# Altium schematic sheet Connector.SchDoc: CONNECTOR
size A4; DrawnBy: ThanhQuoc; Revision: V01; SheetNumber: 20; SheetTotal: 21; Project: RV1126 CAMERA BOARD DESIGN
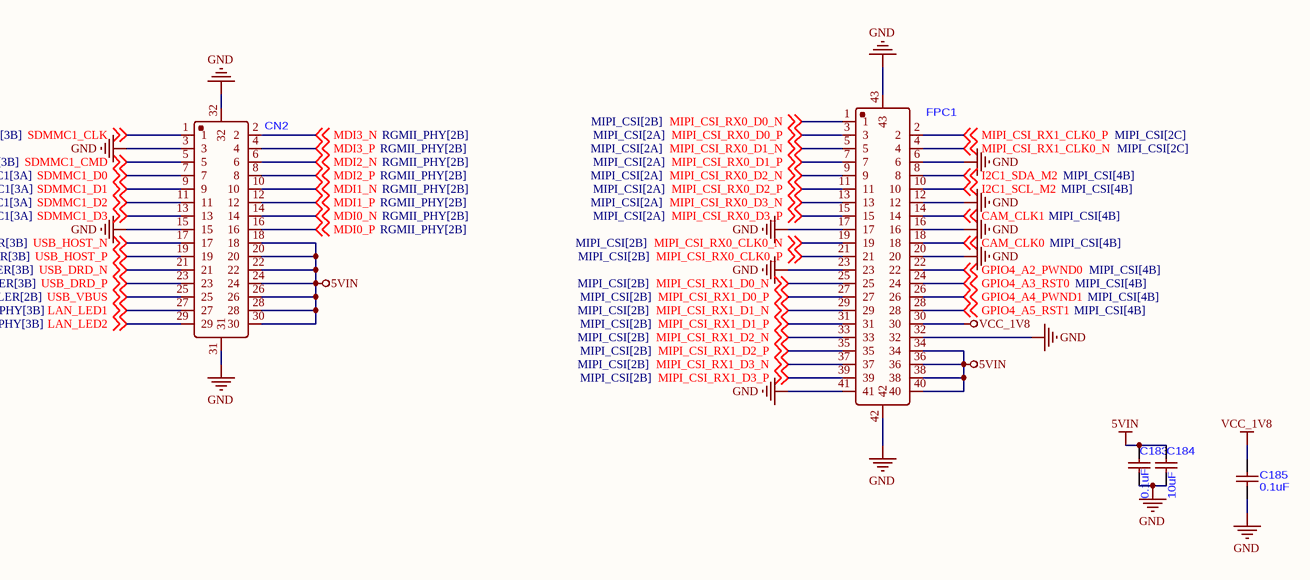
[diagram p0: Connector.SchDoc]

## Parts
C183  0.1uF  [C0201]
C184  10uF  [C0402]
C185  0.1uF  [C0201]
CN2  DF12NB(3.0)-30DP-0.5V(51)  [CONN-SMD_30P-P0.50_HRS_DF12NB-3.0-30DP-0.5V]  (value not drawn)
FPC1  FH35C-41S-0.3SHW(50)  [FPC-SMD_FH35C-41S-0.3SHW-50]  (value not drawn)

## Nets
5VIN: C183.2 C184.2 CN2.18 CN2.20 CN2.22 CN2.24 CN2.26 CN2.28 CN2.30 FPC1.34 FPC1.36 FPC1.38 FPC1.40
GND: C183.1 C184.1 C185.1 CN2.3 CN2.15 CN2.31 CN2.32 FPC1.6 FPC1.12 FPC1.16 FPC1.17 FPC1.20 FPC1.23 FPC1.32 FPC1.41 FPC1.42 FPC1.43
VCC_1V8: C185.2 FPC1.30
CAM_CLK0: FPC1.18 ; off-sheet CAM_CLK0
CAM_CLK1: FPC1.14 ; off-sheet CAM_CLK1
GPIO4_A2_PWND0: FPC1.22 ; off-sheet GPIO4_A2_PWND0
GPIO4_A3_RST0: FPC1.24 ; off-sheet GPIO4_A3_RST0
GPIO4_A4_PWND1: FPC1.26 ; off-sheet GPIO4_A4_PWND1
GPIO4_A5_RST1: FPC1.28 ; off-sheet GPIO4_A5_RST1
I2C1_SCL_M2: FPC1.10 ; off-sheet I2C1_SCL_M2
I2C1_SDA_M2: FPC1.8 ; off-sheet I2C1_SDA_M2
LAN_LED1: CN2.27 ; off-sheet LAN_LED1
LAN_LED2: CN2.29 ; off-sheet LAN_LED2
MDI0_N: CN2.14 ; off-sheet MDI0_N
MDI0_P: CN2.16 ; off-sheet MDI0_P
MDI1_N: CN2.10 ; off-sheet MDI1_N
MDI1_P: CN2.12 ; off-sheet MDI1_P
MDI2_N: CN2.6 ; off-sheet MDI2_N
MDI2_P: CN2.8 ; off-sheet MDI2_P
MDI3_N: CN2.2 ; off-sheet MDI3_N
MDI3_P: CN2.4 ; off-sheet MDI3_P
MIPI_CSI_RX0_CLK0_N: FPC1.19 ; off-sheet MIPI_CSI_RX0_CLK0_N
MIPI_CSI_RX0_CLK0_P: FPC1.21 ; off-sheet MIPI_CSI_RX0_CLK0_P
MIPI_CSI_RX0_D0_N: FPC1.1 ; off-sheet MIPI_CSI_RX0_D0_N
MIPI_CSI_RX0_D0_P: FPC1.3 ; off-sheet MIPI_CSI_RX0_D0_P
MIPI_CSI_RX0_D1_N: FPC1.5 ; off-sheet MIPI_CSI_RX0_D1_N
MIPI_CSI_RX0_D1_P: FPC1.7 ; off-sheet MIPI_CSI_RX0_D1_P
MIPI_CSI_RX0_D2_N: FPC1.9 ; off-sheet MIPI_CSI_RX0_D2_N
MIPI_CSI_RX0_D2_P: FPC1.11 ; off-sheet MIPI_CSI_RX0_D2_P
MIPI_CSI_RX0_D3_N: FPC1.13 ; off-sheet MIPI_CSI_RX0_D3_N
MIPI_CSI_RX0_D3_P: FPC1.15 ; off-sheet MIPI_CSI_RX0_D3_P
MIPI_CSI_RX1_CLK0_N: FPC1.4 ; off-sheet MIPI_CSI_RX1_CLK0_N
MIPI_CSI_RX1_CLK0_P: FPC1.2 ; off-sheet MIPI_CSI_RX1_CLK0_P
MIPI_CSI_RX1_D0_N: FPC1.25 ; off-sheet MIPI_CSI_RX1_D0_N
MIPI_CSI_RX1_D0_P: FPC1.27 ; off-sheet MIPI_CSI_RX1_D0_P
MIPI_CSI_RX1_D1_N: FPC1.29 ; off-sheet MIPI_CSI_RX1_D1_N
MIPI_CSI_RX1_D1_P: FPC1.31 ; off-sheet MIPI_CSI_RX1_D1_P
MIPI_CSI_RX1_D2_N: FPC1.33 ; off-sheet MIPI_CSI_RX1_D2_N
MIPI_CSI_RX1_D2_P: FPC1.35 ; off-sheet MIPI_CSI_RX1_D2_P
MIPI_CSI_RX1_D3_N: FPC1.37 ; off-sheet MIPI_CSI_RX1_D3_N
MIPI_CSI_RX1_D3_P: FPC1.39 ; off-sheet MIPI_CSI_RX1_D3_P
SDMMC1_CLK: CN2.1 ; off-sheet SDMMC1_CLK
SDMMC1_CMD: CN2.5 ; off-sheet SDMMC1_CMD
SDMMC1_D0: CN2.7 ; off-sheet SDMMC1_D0
SDMMC1_D1: CN2.9 ; off-sheet SDMMC1_D1
SDMMC1_D2: CN2.11 ; off-sheet SDMMC1_D2
SDMMC1_D3: CN2.13 ; off-sheet SDMMC1_D3
USB_DRD_N: CN2.21 ; off-sheet USB_DRD_N
USB_DRD_P: CN2.23 ; off-sheet USB_DRD_P
USB_HOST_N: CN2.17 ; off-sheet USB_HOST_N
USB_HOST_P: CN2.19 ; off-sheet USB_HOST_P
USB_VBUS: CN2.25 ; off-sheet USB_VBUS

## Notes on the sheet
- Title:
- Drawn By:
- Page Contents:
- Checked By:
- Size:
- Date:
- File:
- License:
- Email:
- A4
- nguyenthanhquoc0206@gmail.com
- Number:
- Time:
- Revision:
- Sheet
- Website:
- of
- https://www.facebook.com/ntq.687

## Library data of the parts
C183 C185 = CAP_100nF-6.3V-10%-0201_1: 0.1uF ±10% 6.3V Ceramic Capacitor X5R 0201
C184 = CAP_10uF-10V-20%-0402: 10µF ±20% 10V Ceramic Capacitor X5R 0402 (1005 Metric)
CN2 = DF12NB(3.0)-30DP-0.5V(51): 0.5mm Pitch SMT Board-to-Board Connectors, 5Gbps Transmission Speed
FPC1 = FH35C-41S-0.3SHW(50): CONN FFC FPC 41POS 0.3mm TOP AND BOTTOM CNT SMD R/A